# Altium schematic sheet 主控制芯片.SchDoc
size A3
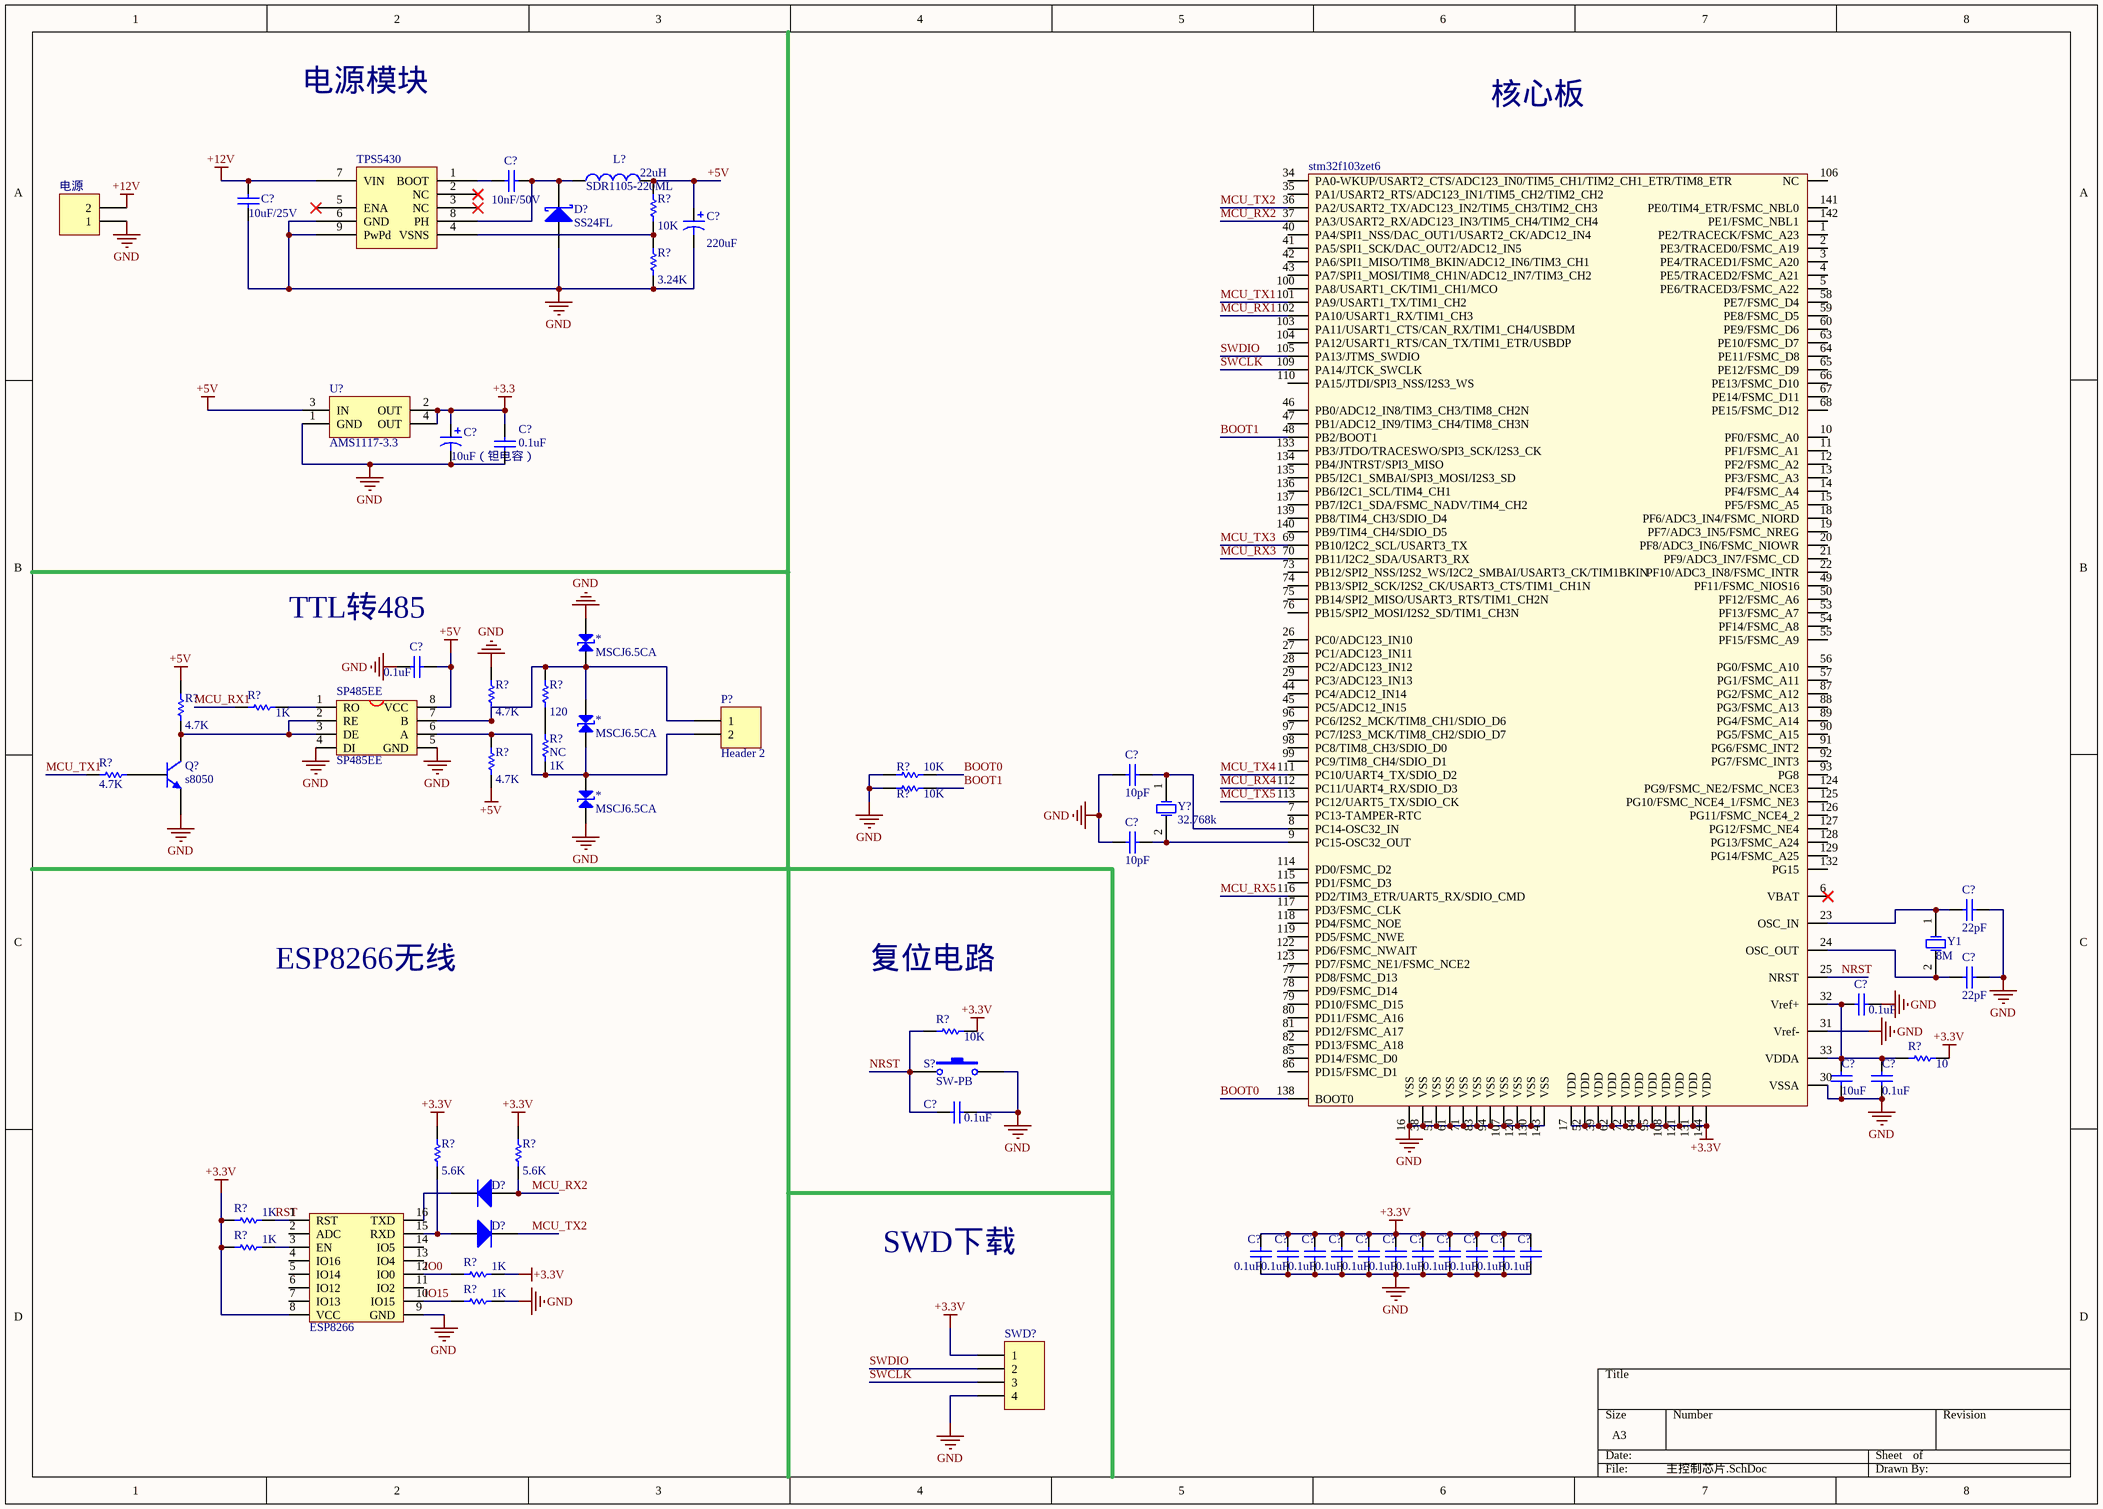
[diagram p0: 主控制芯片.SchDoc]

## Parts
(Parts that share a designator on the sheet are numbered #1, #2 ... from top to bottom, then left to right.)
*#1  MSCJ6.5CA
*#2  MSCJ6.5CA
*#3  MSCJ6.5CA
C?#1  value 10nF/50V  [0805]  (hidden comment: C0805C103K5RACTU)
C?#2  value 10uF/25V  [1206]  (hidden comment: GRM31CR61E106KA12L)
C?#3  value 220uF  [钽电容(B)]  (hidden comment: 6TPE220MAZB)
C?#4  10uF（钽电容）  [5025]
C?#5  0.1uF  [0805]
C?#6  value 0.1uF  [RAD-0.3]  (hidden comment: 104)
C?#7  value 10pF  [0805]  (hidden comment: 15)
C?#8  value 10pF  [0805]  (hidden comment: 15)
C?#9  value 22pF  [0805]  (hidden comment: 22)
C?#10  value 22pF  [0805]  (hidden comment: 22)
C?#11  value 0.1uF  [RAD-0.3]  (hidden comment: 104)
C?#12  value 10uF  [RAD-0.3]  (hidden comment: 106)
C?#13  value 0.1uF  [RAD-0.3]  (hidden comment: 104)
C?#14  value 0.1uF  [0805]  (hidden comment: 104)
C?#15  value 0.1uF  [0805]  (hidden comment: 104)
C?#16  value 0.1uF  [0805]  (hidden comment: 104)
C?#17  value 0.1uF  [0805]  (hidden comment: 104)
C?#18  value 0.1uF  [0805]  (hidden comment: 104)
C?#19  value 0.1uF  [0805]  (hidden comment: 104)
C?#20  value 0.1uF  [0805]  (hidden comment: 104)
C?#21  value 0.1uF  [0805]  (hidden comment: 104)
C?#22  value 0.1uF  [0805]  (hidden comment: 104)
C?#23  value 0.1uF  [0805]  (hidden comment: 104)
C?#24  value 0.1uF  [0805]  (hidden comment: 104)
C?#25  value 0.1uF  [0805]  (hidden comment: 104)
D?#1  SS24FL  [SS24fl]
D?#2  MBR0520  [DO-41]  (value not drawn)
D?#3  MBR0520  [DO-41]  (value not drawn)
ESP8266  ESP8266  (value not drawn)
L?  SDR1105-220ML  value 22uH  [inductor]
P?  Header 2  [HDR1X2]
Q?  s8050  [TO-226-AA]
R?#1  10K  [0805]
R?#2  3.24K  [0805]
R?#3  4.7k  [AXIAL-0.3]
R?#4  4.7k  [AXIAL-0.3]
R?#5  1K  [AXIAL-0.3]
R?#6  120  [AXIAL-0.3]
R?#7  4.7k  [AXIAL-0.3]
R?#8  4.7k  [AXIAL-0.3]
R?#9  NC  value 1K  [AXIAL-0.3]
R?#10  10K  [0805]
R?#11  10K  [0805]
R?#12  10K  [0805]
R?#13  10  [AXIAL-0.3]
R?#14  5.6K  [AXIAL-0.3]
R?#15  5.6K  [AXIAL-0.3]
R?#16  1K  [AXIAL-0.3]
R?#17  1K  [AXIAL-0.3]
R?#18  1K  [AXIAL-0.3]
R?#19  1K  [AXIAL-0.3]
S?  SW-PB  [key]
SP485EE  SP485EE
stm32f103zet6  stm32f103zet6  (value not drawn)
SWD?  Header 4  [SWD]  (value not drawn)
TPS5430  TPS5430DDAR  [TPS5430]  (value not drawn)
U?  AMS1117-3.3  [1117-3.3]
Y1  8M  [XTAL-B]
Y?  32.768k  [XTAL-B]
电源  DUANZI  [DUANZI]  (value not drawn)

## Nets
+3.3: C?#4.1 C?#5.2 U?.2(OUT) U?.4(OUT)
+3.3V: C?#15.1 C?#16.1 C?#17.1 C?#18.1 C?#19.1 C?#20.1 C?#21.1 C?#22.1 C?#23.1 C?#24.1 C?#25.1 ESP8266.8(VCC) R?#12.2 R?#13.2 R?#14.2 R?#15.2 R?#16.1 R?#17.1 R?#18.2 stm32f103zet6.17(VDD) stm32f103zet6.39(VDD) stm32f103zet6.52(VDD) stm32f103zet6.62(VDD) stm32f103zet6.72(VDD) stm32f103zet6.84(VDD) stm32f103zet6.95(VDD) stm32f103zet6.108(VDD) stm32f103zet6.121(VDD) stm32f103zet6.131(VDD) stm32f103zet6.144(VDD) SWD?.1
+5V: C?#3.1 C?#6.2 L?.2 R?#1.2 R?#4.1 R?#7.2 SP485EE.8(VCC) U?.3(IN)
+12V: C?#2.1 TPS5430.7(VIN) 电源.2
GND: *#1.2 *#3.1 C?#2.2 C?#3.2 C?#4.2 C?#5.1 C?#6.1 C?#7.2 C?#8.2 C?#9.1 C?#10.1 C?#11.1 C?#12.2 C?#13.2 C?#14.2 C?#15.2 C?#16.2 C?#17.2 C?#18.2 C?#19.2 C?#20.2 C?#21.2 C?#22.2 C?#23.2 C?#24.2 C?#25.2 D?#1.1(A) ESP8266.9(GND) Q?.3(E) R?#2.1 R?#3.1 R?#10.2 R?#11.2 R?#19.2 S?.2 SP485EE.4(DI) SP485EE.5(GND) stm32f103zet6.16(VSS) stm32f103zet6.30(VSSA) stm32f103zet6.31(Vref-) stm32f103zet6.38(VSS) stm32f103zet6.51(VSS) stm32f103zet6.61(VSS) stm32f103zet6.71(VSS) stm32f103zet6.83(VSS) stm32f103zet6.94(VSS) stm32f103zet6.107(VSS) stm32f103zet6.120(VSS) stm32f103zet6.130(VSS) stm32f103zet6.143(VSS) SWD?.4 TPS5430.6(GND) TPS5430.9(PwPd) U?.1(GND) 电源.1
BOOT0: R?#10.1 stm32f103zet6.138(BOOT0)
BOOT1: R?#11.1 stm32f103zet6.48(PB2/BOOT1)
IO0: ESP8266.12(IO0) R?#18.1
IO15: ESP8266.10(IO15) R?#19.1
MCU_RX1: R?#5.1 stm32f103zet6.102(PA10/USART1_RX/TIM1_CH3)
MCU_RX2: D?#2.1(A) R?#15.1 stm32f103zet6.37(PA3/USART2_RX/ADC123_IN3/TIM5_CH4/TIM2_CH4)
MCU_RX3: stm32f103zet6.70(PB11/I2C2_SDA/USART3_RX)
MCU_RX4: stm32f103zet6.112(PC11/UART4_RX/SDIO_D3)
MCU_RX5: stm32f103zet6.116(PD2/TIM3_ETR/UART5_RX/SDIO_CMD)
MCU_TX1: R?#8.1 stm32f103zet6.101(PA9/USART1_TX/TIM1_CH2)
MCU_TX2: D?#3.2(K) stm32f103zet6.36(PA2/USART2_TX/ADC123_IN2/TIM5_CH3/TIM2_CH3)
MCU_TX3: stm32f103zet6.69(PB10/I2C2_SCL/USART3_TX)
MCU_TX4: stm32f103zet6.111(PC10/UART4_TX/SDIO_D2)
MCU_TX5: stm32f103zet6.113(PC12/UART5_TX/SDIO_CK)
NRST: C?#14.1 R?#12.1 S?.1 stm32f103zet6.25(NRST)
RST: ESP8266.1(RST) R?#16.2
SWCLK: stm32f103zet6.109(PA14/JTCK_SWCLK) SWD?.3
SWDIO: stm32f103zet6.105(PA13/JTMS_SWDIO) SWD?.2
Net*#1_1: *#1.1 *#2.2 P?.1 R?#3.2 R?#6.2 SP485EE.7(B)
Net*#2_1: *#2.1 *#3.2 P?.2 R?#7.1 R?#9.1 SP485EE.6(A)
NetC?#1_1: C?#1.1 TPS5430.1(BOOT)
NetC?#1_2: C?#1.2 D?#1.2(K) L?.1 TPS5430.8(PH)
NetC?#7_1: C?#7.1 stm32f103zet6.8(PC14-OSC32_IN) Y?.1(OSC1)
NetC?#8_1: C?#8.1 stm32f103zet6.9(PC15-OSC32_OUT) Y?.2(OSC2)
NetC?#9_2: C?#9.2 stm32f103zet6.23(OSC_IN) Y1.1(OSC1)
NetC?#10_2: C?#10.2 stm32f103zet6.24(OSC_OUT) Y1.2(OSC2)
NetC?#11_2: C?#11.2 C?#12.1 C?#13.1 R?#13.1 stm32f103zet6.32(Vref+) stm32f103zet6.33(VDDA)
NetD?#2_2: D?#2.2(K) ESP8266.16(TXD)
NetD?#3_1: D?#3.1(A) ESP8266.15(RXD) R?#14.1
NetESP8266_3: ESP8266.3(EN) R?#17.2
NetQ?_1: Q?.1(C) R?#4.2 SP485EE.2(RE) SP485EE.3(DE)
NetQ?_2: Q?.2(B) R?#8.2
NetR?#1_1: R?#1.1 R?#2.2 TPS5430.4(VSNS)
NetR?#5_2: R?#5.2 SP485EE.1(RO)
NetR?#6_1: R?#6.1 R?#9.2

Not connected (* = marked no-connect by the designer): ESP8266 2(ADC) 4(IO16) 5(IO14) 6(IO12) 7(IO13) 11(IO2) 13(IO4) 14(IO5); stm32f103zet6 1(PE2/TRACECK/FSMC_A23) 2(PE3/TRACED0/FSMC_A19) 3(PE4/TRACED1/FSMC_A20) 4(PE5/TRACED2/FSMC_A21) 5(PE6/TRACED3/FSMC_A22) 6(VBAT)* 7(PC13-TAMPER-RTC) 10(PF0/FSMC_A0) 11(PF1/FSMC_A1) 12(PF2/FSMC_A2) 13(PF3/FSMC_A3) 14(PF4/FSMC_A4) 15(PF5/FSMC_A5) 18(PF6/ADC3_IN4/FSMC_NIORD) 19(PF7/ADC3_IN5/FSMC_NREG) 20(PF8/ADC3_IN6/FSMC_NIOWR) 21(PF9/ADC3_IN7/FSMC_CD) 22(PF10/ADC3_IN8/FSMC_INTR) 26(PC0/ADC123_IN10) 27(PC1/ADC123_IN11) 28(PC2/ADC123_IN12) 29(PC3/ADC123_IN13) 34(PA0-WKUP/USART2_CTS/ADC123_IN0/TIM5_CH1/TIM2_CH1_ETR/TIM8_ETR) 35(PA1/USART2_RTS/ADC123_IN1/TIM5_CH2/TIM2_CH2) 40(PA4/SPI1_NSS/DAC_OUT1/USART2_CK/ADC12_IN4) 41(PA5/SPI1_SCK/DAC_OUT2/ADC12_IN5) 42(PA6/SPI1_MISO/TIM8_BKIN/ADC12_IN6/TIM3_CH1) 43(PA7/SPI1_MOSI/TIM8_CH1N/ADC12_IN7/TIM3_CH2) 44(PC4/ADC12_IN14) 45(PC5/ADC12_IN15) 46(PB0/ADC12_IN8/TIM3_CH3/TIM8_CH2N) 47(PB1/ADC12_IN9/TIM3_CH4/TIM8_CH3N) 49(PF11/FSMC_NIOS16) 50(PF12/FSMC_A6) 53(PF13/FSMC_A7) 54(PF14/FSMC_A8) 55(PF15/FSMC_A9) 56(PG0/FSMC_A10) 57(PG1/FSMC_A11) 58(PE7/FSMC_D4) 59(PE8/FSMC_D5) 60(PE9/FSMC_D6) 63(PE10/FSMC_D7) 64(PE11/FSMC_D8) 65(PE12/FSMC_D9) 66(PE13/FSMC_D10) 67(PE14/FSMC_D11) 68(PE15/FSMC_D12) 73(PB12/SPI2_NSS/I2S2_WS/I2C2_SMBAI/USART3_CK/TIM1BKIN) 74(PB13/SPI2_SCK/I2S2_CK/USART3_CTS/TIM1_CH1N) 75(PB14/SPI2_MISO/USART3_RTS/TIM1_CH2N) 76(PB15/SPI2_MOSI/I2S2_SD/TIM1_CH3N) 77(PD8/FSMC_D13) 78(PD9/FSMC_D14) 79(PD10/FSMC_D15) 80(PD11/FSMC_A16) 81(PD12/FSMC_A17) 82(PD13/FSMC_A18) 85(PD14/FSMC_D0) 86(PD15/FSMC_D1) 87(PG2/FSMC_A12) 88(PG3/FSMC_A13) 89(PG4/FSMC_A14) 90(PG5/FSMC_A15) 91(PG6/FSMC_INT2) 92(PG7/FSMC_INT3) 93(PG8) 96(PC6/I2S2_MCK/TIM8_CH1/SDIO_D6) 97(PC7/I2S3_MCK/TIM8_CH2/SDIO_D7) 98(PC8/TIM8_CH3/SDIO_D0) 99(PC9/TIM8_CH4/SDIO_D1) 100(PA8/USART1_CK/TIM1_CH1/MCO) 103(PA11/USART1_CTS/CAN_RX/TIM1_CH4/USBDM) 104(PA12/USART1_RTS/CAN_TX/TIM1_ETR/USBDP) 106(NC) 110(PA15/JTDI/SPI3_NSS/I2S3_WS) 114(PD0/FSMC_D2) 115(PD1/FSMC_D3) 117(PD3/FSMC_CLK) 118(PD4/FSMC_NOE) 119(PD5/FSMC_NWE) 122(PD6/FSMC_NWAIT) 123(PD7/FSMC_NE1/FSMC_NCE2) 124(PG9/FSMC_NE2/FSMC_NCE3) 125(PG10/FSMC_NCE4_1/FSMC_NE3) 126(PG11/FSMC_NCE4_2) 127(PG12/FSMC_NE4) 128(PG13/FSMC_A24) 129(PG14/FSMC_A25) 132(PG15) 133(PB3/JTDO/TRACESWO/SPI3_SCK/I2S3_CK) 134(PB4/JNTRST/SPI3_MISO) 135(PB5/I2C1_SMBAI/SPI3_MOSI/I2S3_SD) 136(PB6/I2C1_SCL/TIM4_CH1) 137(PB7/I2C1_SDA/FSMC_NADV/TIM4_CH2) 139(PB8/TIM4_CH3/SDIO_D4) 140(PB9/TIM4_CH4/SDIO_D5) 141(PE0/TIM4_ETR/FSMC_NBL0) 142(PE1/FSMC_NBL1); TPS5430 2(NC)* 3(NC)* 5(ENA)*

## Notes on the sheet
- 电源模块
- 核心板
- (near C?#6) TTL转485
- ESP8266无线
- 复位电路
- SWD下载

## Library data of the parts
C?#1 C?#2 C?#5-C?#25 = Cap: Capacitor; Published: 8-Jun-2000; LatestRevisionDate: 17-Jul-2002; LatestRevisionNote: Re-released for DXP Platform.; PackageReference: RAD-0.3; Publisher: Altium Limited
  C?#1 C?#2 C?#6 C?#11-C?#14: PackageDescription: Radial Cap, Thru-Hole; 2 Leads; 0.3 in Pin Spacing
  C?#5: Value: 0.1uF
C?#3 = Cap Pol1: Polarized Capacitor (Radial); Published: 8-Jun-2000; LatestRevisionDate: 17-Jul-2002; LatestRevisionNote: Re-released for DXP Platform.; PackageReference: RB7.6-15; Publisher: Altium Limited; PackageDescription: Polarized Capacitor (Radial); 2 Leads
C?#4 = Cap Pol1: Polarized Capacitor (Radial); Value: 10uF; Published: 8-Jun-2000; LatestRevisionDate: 17-Jul-2002; LatestRevisionNote: Re-released for DXP Platform.; PackageReference: RB7.6-15; Publisher: Altium Limited
D?#1 = D Schottky: Schottky Diode; Published: 8-Jun-2000; LatestRevisionDate: 17-Jul-2002; LatestRevisionNote: Re-released for DXP Platform.; PackageReference: SMB; Publisher: Altium Limited; PackageDescription: DO-214-AA/SMB; 2 C-Bend Leads; Body 5.3 x 3.6 mm, inc. leads (LxW); Code_JEDEC: DO-214-AA
D?#2 D?#3 = Diode 1N4001: 1 Amp General Purpose Rectifier; Published: 8-Jun-2000; LatestRevisionDate: 17-Jul-2002; LatestRevisionNote: Re-released for DXP Platform.; DatasheetVersion: 1998; PackageVersion: Aug-1999; PackageReference: DO-41; Publisher: Altium Limited; PackageDescription: Diode, Axial; Body 5.2 x 2.7 mm (LxDia. max), Lead Dia. 0.86 mm (max); Code_JEDEC: DO-204-AL; ComponentLink1Description: Manufacturer Link; ComponentLink1URL: http://www.fairchildsemi.com/; ComponentLink2Description: Datasheet; ComponentLink2URL: http://www.fairchildsemi.com/ds/1N%2F1N4001.pdf
L? = Inductor: Code_IEC: 1005; Published: 8-Jun-2000; LatestRevisionDate: 29-May-2009; LatestRevisionNote: IPC-7351 Footprint Added.; PackageReference: 0402-A; Publisher: Altium Limited; PackageDescription: Chip Inductor; Code_JEITA: 0402
P? 电源 = Header 2: Header, 2-Pin; LatestRevisionDate: 17-Jul-2002; LatestRevisionNote: Re-released for DXP Platform.; Publisher: Altium Limited
Q? = NPN: NPN Bipolar Transistor; Published: 8-Jun-2000; LatestRevisionDate: 17-Jul-2002; LatestRevisionNote: Re-released for DXP Platform.; PackageReference: TO-226-AA; Publisher: Altium Limited; PackageDescription: TO, Flat Index; 3 In-Line, Axial Leads; Body Dia. 4.8mm; Leads 0.55 x 0.51 mm (max); Code_JEDEC: TO-226-AA
R?#1-R?#19 = Res1: Resistor; Published: 8-Jun-2000; LatestRevisionDate: 17-Jul-2002; LatestRevisionNote: Re-released for DXP Platform.; PackageReference: AXIAL-0.3; Publisher: Altium Limited; PackageDescription: Axial Device, Thru-Hole; 2 Leads; 0.3 in Pin Spacing
  R?#1 R?#10-R?#12: Value: 10K
  R?#2: Value: 3.24K
  R?#3 R?#4 R?#7 R?#8: Value: 4.7K
  R?#5 R?#16-R?#19: Value: 1K
  R?#6: Value: 120
  R?#13: Value: 10
  R?#14 R?#15: Value: 5.6K
S? = SW-PB: Switch; Published: 24-Mar-1999; LatestRevisionDate: 17-Jul-2002; LatestRevisionNote: Re-released for DXP Platform.; PackageReference: SPST-2; Publisher: Altium Limited; PackageDescription: Switch; 2 Leads
SWD? = Header 4: Header, 4-Pin; LatestRevisionDate: 17-Jul-2002; LatestRevisionNote: Re-released for DXP Platform.; Publisher: Altium Limited
TPS5430 = TPS5430
U? = REG1117-3.3: 800mA and 1A Low Dropout Positive Regulator 2.85V, 3.3V, 5V, and Adjustable; Published: 8-Jun-2000; LatestRevisionDate: 17-Jul-2002; LatestRevisionNote: Re-released for DXP Platform.; DatasheetVersion: Sep-1997; PackageVersion: revC; PackageReference: ZZ311; Publisher: Altium Limited; PackageDescription: SOT-223/SC-73; 4 Leads; Body 6.7 x 7.3 mm, inc. leads (LxW max); ComponentLink1Description: Manufacturer Link; ComponentLink1URL: http://www.ti.com/; ComponentLink2Description: Datasheet; ComponentLink2URL: http://www-s.ti.com/sc/ds/REG1117.pdf
Y1 Y? = XTAL: Crystal Oscillator; Published: 8-Jun-2000; LatestRevisionDate: 17-Jul-2002; LatestRevisionNote: Re-released for DXP Platform.; PackageReference: R38; Publisher: Altium Limited